# Altium schematic sheet CT_switching.SchDoc: Triumvi - Sensing - CT Switching
size Letter; Author: Ye-Sheng Kuo; Revision: 10; SheetNumber: 5; SheetTotal: 6
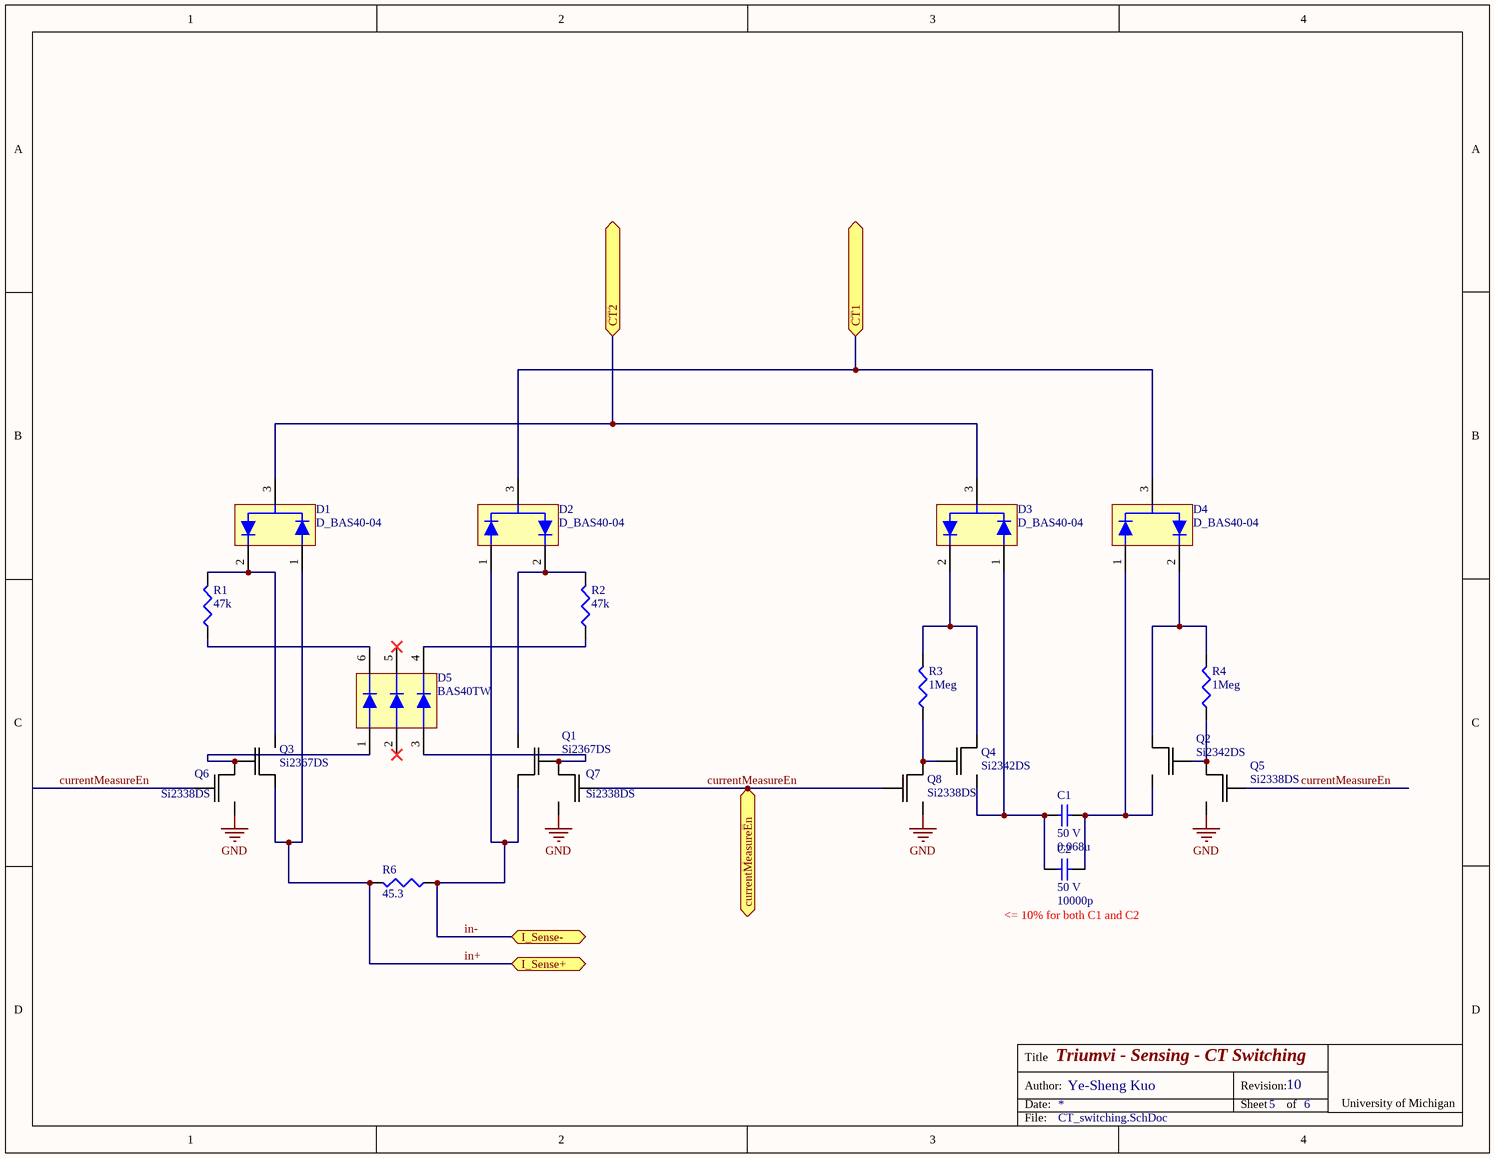
[diagram p0: CT_switching.SchDoc]

## Parts
C1  voltage rated: 50 V  [0603]  (hidden comment: 0.068u)
C2  voltage rated: 50 V  [0603]  (hidden comment: 10000p)
D1  D_BAS40-04  [SOT23-3]
D2  D_BAS40-04  [SOT23-3]
D3  D_BAS40-04  [SOT23-3]
D4  D_BAS40-04  [SOT23-3]
D5  BAS40TW  [SOT-363]
Q1  Si2367DS  [SOT23-3]
Q2  Si2342DS  [SOT23-3]
Q3  Si2367DS  [SOT23-3]
Q4  Si2342DS  [SOT23-3]
Q5  Si2338DS  [SOT23-3]
Q6  Si2338DS  [SOT23-3]
Q7  Si2338DS  [SOT23-3]
Q8  Si2338DS  [SOT23-3]
R1  47k  [0402]
R2  47k  [0402]
R3  1Meg  [0402]
R4  1Meg  [0402]
R6  45.3  [0603]

## Ports
CT1, CT2, currentMeasureEn, I_Sense+, I_Sense-

## Nets
GND: Q5.2(S) Q6.2(S) Q7.2(S) Q8.2(S)
CT1: D2.3 D4.3 ; port CT1
CT2: D1.3 D3.3 ; port CT2
currentMeasureEn: Q5.1(G) Q6.1(G) Q7.1(G) Q8.1(G) ; port currentMeasureEn
in+: D1.1 Q3.3(D) R6.1 ; port I_Sense+
in-: D2.1 Q1.3(D) R6.2 ; port I_Sense-
NetC1_1: C1.1 C2.1 D3.1 Q4.2(S)
NetC1_2: C1.2 C2.2 D4.1 Q2.2(S)
NetD1_2: D1.2 Q3.2(S) R1.1
NetD2_2: D2.2 Q1.2(S) R2.1
NetD3_2: D3.2 Q4.3(D) R3.1
NetD4_2: D4.2 Q2.3(D) R4.1
NetD5_1: D5.1 Q3.1(G) Q6.3(D)
NetD5_3: D5.3 Q1.1(G) Q7.3(D)
NetD5_4: D5.4 R2.2
NetD5_6: D5.6 R1.2
NetQ2_1: Q2.1(G) Q5.3(D) R4.2
NetQ4_1: Q4.1(G) Q8.3(D) R3.2

Not connected (* = marked no-connect by the designer): D5 2* 5*

## Notes on the sheet
- (near C2) <= 10% for both C1 and C2
- Title
- Date:
- Author:
- Revision:
- Sheet
- of
- University of Michigan
- File:

## Library data of the parts
C1 = C0603C683K5RACTU: 0.068µF ±10% 50V Ceramic Capacitor X7R 0603; Manufacture: Kemet; tolerance: 10%; package: 0603; Supplier 1: Digi-Key; Supplier Part Number 1: 399-7955-1-ND; Value: 0.068u; Temperature Coefficient: X7R; Manufacturer Part Number: C0603C683K5RACTU
C2 = C0603C103J5RACTU: 10000pF ±5% 50V Ceramic Capacitor X7R 0603; Manufacture: Kemet; tolerance: 5%; package: 0603; Supplier 1: Digi-Key; Supplier Part Number 1: 399-1092-6-ND; Value: 10000p; Temperature Coefficient: X7R; Manufacturer Part Number: C0603C103J5RACTU
D1-D4 = D_BAS40-04: SURFACE MOUNT SCHOTTKY BARRIER DIODE; Supplier 1: Digi-Key; Supplier Part Number 1: BAS40-04FDICT-ND
D5 = D_BAS40TW: SURFACE MOUNT SCHOTTKY BARRIER DIODE ARRAYS; Supplier 1: Digi-Key; Supplier Part Number 1: BAS40TW-FDICT-ND
Q1 Q3 = Si2367DS: P-Channel 20 V (D-S) MOSFET; Supplier 1: Digi-Key; Supplier Part Number 1: SI2367DS-T1-GE3CT-ND
Q2 Q4 = Si2342DS: N-Channel 8 V (D-S) MOSFET; Supplier 1: Digi-Key; Supplier Part Number 1: SI2342DS-T1-GE3CT-ND
Q5-Q8 = Si2338DS: N-Channel 30 V (D-S) MOSFET; Supplier 1: Digi-Key; Supplier Part Number 1: SI2338DS-T1-GE3CT-ND
R1 R2 = CRCW040247K0FKED: RES SMD 47K OHM 1% 1/16W 0402; Manufacturer: Vishay Dale; Temperature Coefficient: 100 ppm/C; Tolerance: 1%; Power: 1/16 W; package: 0402; Supplier 1: Digi-Key; Supplier Part Number 1: 541-47.0KLCT-ND; value: 47k; Manufacturer Part Number: CRCW040247K0FKED
R3 R4 = CRCW04021M00FKED: RES SMD 1M OHM 1% 1/16W 0402; Manufacturer: Vishay Dale; Temperature Coefficient: 100 ppm/C; Tolerance: 1%; Power: 1/16 W; Supplier 1: Digi-Key; Supplier Part Number 1: 541-1.00MLCT-ND; package: 0402; value: 1Meg; Manufacturer Part Number: CRCW04021M00FKED
R6 = RP73PF1J45R3BTDF: RES SMD 45.3 OHM 0.1% 1/6W 0603; Manufacturer: TE Connectivity; Temperature Coefficient: 25 ppm/C; Power: 1/6 W; package: 0603; Supplier 1: Digi-Key; Supplier Part Number 1: A109979CT-ND; Tolerance: 0.1%; value: 45.3; Manufacturer Part Number: RP73PF1J45R3BTDF